# Altium schematic sheet POWER_SUPPLY.SchDoc
size D; SheetNumber: 6; SheetTotal: 7
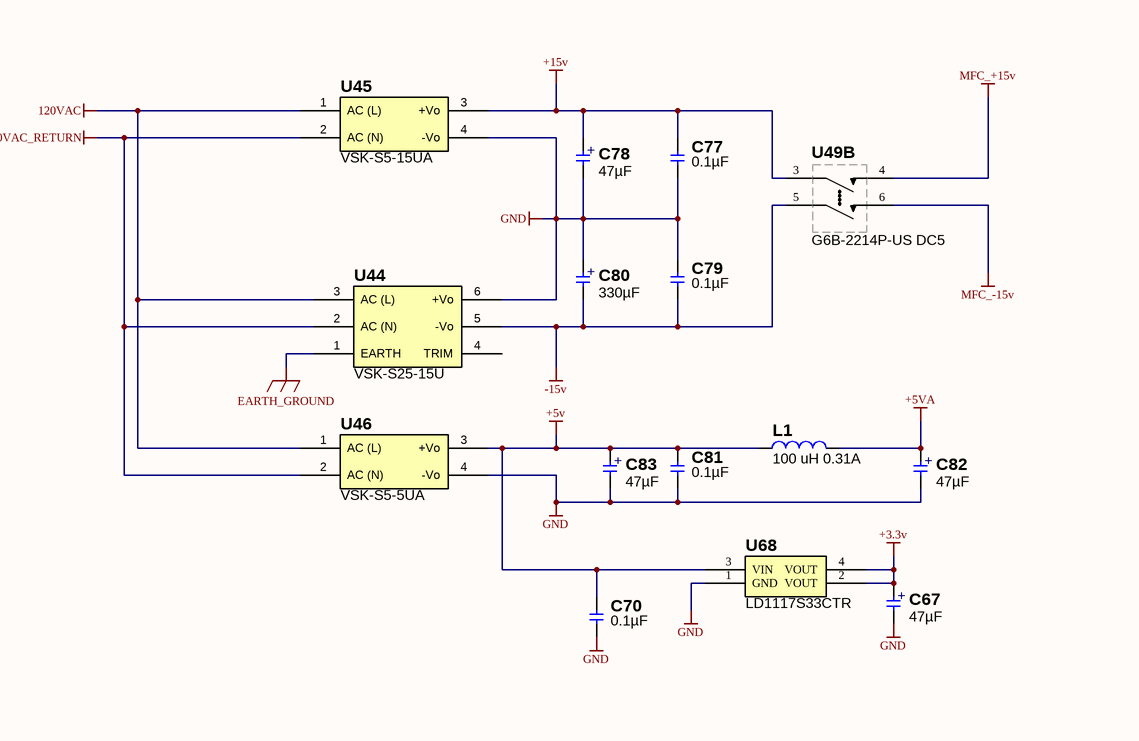
[diagram p0: POWER_SUPPLY.SchDoc, left]
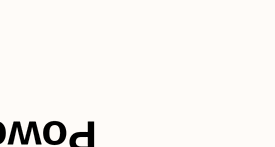
[diagram p1: POWER_SUPPLY.SchDoc, right]

## Parts
C67  47µF  [C_ALU_D]
C70  0.1µF  [C0805_LD]
C77  0.1µF  [C0805_LD]
C78  47µF  [C_ALU_D]
C79  0.1µF  [C0805_LD]
C80  330µF  [C_ALU_F]
C81  0.1µF  [C0805_LD]
C82  47µF  [C_ALU_D]
C83  47µF  [C_ALU_D]
L1  100 uH 0.31A  [L_DO1608C]
U44  VSK-S25-15U  [VSK-S25]
U45  VSK-S5-15UA  [VSK-S5]
U46  VSK-S5-5UA  [VSK-S5]
U49  G6B-2214P-US DC5  [G6B-2214P-US]  (part B of 2)
U68  LD1117S33CTR  [SOT223]

## Nets
120VAC: U44.3(AC_(L)) U45.1(AC_(L)) U46.1(AC_(L))
120VAC_RETURN: U44.2(AC_(N)) U45.2(AC_(N)) U46.2(AC_(N))
+3.3v: C67.1 U68.2(VOUT) U68.4(VOUT)
+5v: C70.2 C81.2 C83.1 L1.1 U46.3(+Vo) U68.3(VIN)
+5VA: C82.1 L1.2
+15v: C77.2 C78.1 U45.3(+Vo) U49.3
-15v: C79.1 C80.2 U44.5(-Vo) U49.5
EARTH_GROUND: U44.1(EARTH)
GND: C67.2 C70.1 C77.1 C78.2 C79.2 C80.1 C81.1 C82.2 C83.2 U44.6(+Vo) U45.4(-Vo) U46.4(-Vo) U68.1(GND)
MFC_+15v: U49.4
MFC_-15v: U49.6

Not connected (* = marked no-connect by the designer): U44 4(TRIM)

## Notes on the sheet
- Power Supply
- -1
- Wavenumber LLC
- 2pl
- Rev:
- Sheet
- of
- (in symbol EEE-FK1E331P) +
- (in symbol EEE-FK1E470P) +

## Library data of the parts
C67 C78 C82 C83 = EEE-FK1E470P: CAP ALUM 47UF 25V 20% SMD; Manufacturer: Panasonic Electronic Components; Lifetime @ Temp#: 2000 Hrs @ 105°C; Ripple Current: 240mA; Impedance: 360 mOhm; Surface Mount Land Size: 0.260" L x 0.260" W (6.60mm x 6.60mm); F40: 0P; Value: 47µF; Temperature Coefficient: Temperature Coefficient; Manufacturer Part Number: EEE-FK1E470P; ComponentLink1Description: Internal Datasheet; ComponentLink1URL: http://industrial.panasonic.com/www-cgi/jvcr13pz.cgi?E+PZ+3+ABA0120+EEEFK1E470P+7+WW; ComponentLink2Description: External Datasheet; ComponentLink2URL: http://industrial.panasonic.com/www-cgi/jvcr13pz.cgi?E+PZ+3+ABA0120+EEEFK1E470P+7+WW; Stocked: 0; Supplier 1: Digi-Key; Supplier Part Number 1: PCE3804CT-ND; Category: Capacitors; SortValue: 47000000; Sort Value Package: D_47000000; Pricing: 1 = 0.56  ;  50 = 0.3364  ;  100 = 0.2944  ;  250 = 0.23132  ;  500 = 0.2103 (USD); Sales Status: Active; Capacitance: 47µF; Voltage Rating: 25V; Tolerance: ±20%; Operating Temperature: -55°C ~ 105°C; Features: General Purpose; ESR (Equivalent Series Resistance): -; Mounting Type: Surface Mount; Package / Case: Radial- Can - SMD; Size / Dimension: 0.248" Dia (6.30mm); Height - Seated (Max): 0.228" (5.80mm); Lead Spacing: -; Packaging: Cut Tape (CT); Diameter: 6.30; Height: 5.80; Package: D
C70 C77 C79 C81 = GRM21BR71H104KA01L: CAP CER 0.1UF 50V 10% X7R 0805; Manufacturer: Murata Electronics North America; Value: 0.1µF; Temperature Coefficient: X7R; Manufacturer Part Number: GRM21BR71H104KA01L; ComponentLink1Description: \\altium.sil.arl.psu.edu\Libraries\datasheets\Murata Electronics North America\c02e.pdf; ComponentLink1URL: http://search.murata.co.jp/Ceramy/image/img/A01X/G101/ENG/GRM1555C1HR60WA01-01.pdf; ComponentLink2Description: External Datasheet; ComponentLink2URL: http://www.murata.com/products/catalog/pdf/c02e.pdf; Stocked: 0; Supplier 1: Digi-Key; Supplier Part Number 1: 490-1666-1-ND; Category: Capacitors; Sort Value: 100000; Sort Value Package: 0805_100000; Pricing: 1 = 0.1  ;  10 = 0.046  ;  50 = 0.0248  ;  100 = 0.0209  ;  250 = 0.01712  ;  500 = 0.01464  ;  1000 = 0.0114 (USD); Sales Status: Active; Capacitance: 0.1µF; Voltage - Rated: 50V; Tolerance: ±10%; Mounting Type: Surface Mount- MLCC; Operating Temperature: -55°C ~ 125°C; Applications: General Purpose; Ratings: -; Package / Case: 0805 (2012 Metric); Size / Dimension: 0.079" L x 0.049" W (2.00mm x 1.25mm); Height - Seated (Max): -; Thickness (Max): 0.053" (1.35mm); Lead Spacing: -; Features: -; Packaging: Cut Tape (CT); Lead Style: -; Package: 0805; Thickness: 135
C80 = EEE-FK1E331P: CAP ALUM 330UF 25V 20% SMD; Manufacturer: Panasonic Electronic Components; Lifetime @ Temp#: 2000 Hrs @ 105°C; Ripple Current: 600mA; Impedance: 160 mOhm; Surface Mount Land Size: 0.327" L x 0.327" W (8.30mm x 8.30mm); F40: 1P; Value: 330µF; Temperature Coefficient: Temperature Coefficient; Manufacturer Part Number: EEE-FK1E331P; ComponentLink1Description: Internal Datasheet; ComponentLink1URL: http://industrial.panasonic.com/www-cgi/jvcr13pz.cgi?E+PZ+3+ABA0120+EEEFK1E331P+7+WW; ComponentLink2Description: External Datasheet; ComponentLink2URL: http://industrial.panasonic.com/www-cgi/jvcr13pz.cgi?E+PZ+3+ABA0120+EEEFK1E331P+7+WW; Stocked: 0; Supplier 1: Digi-Key; Supplier Part Number 1: PCE3803CT-ND; Category: Capacitors; SortValue: 330000000; Sort Value Package: F_330000000; Pricing: 1 = 0.93  ;  50 = 0.5948  ;  100 = 0.5353  ;  250 = 0.46096 (USD); Sales Status: Active; Capacitance: 330µF; Voltage Rating: 25V; Tolerance: ±20%; Operating Temperature: -55°C ~ 105°C; Features: General Purpose; ESR (Equivalent Series Resistance): -; Mounting Type: Surface Mount; Package / Case: Radial- Can - SMD; Size / Dimension: 0.315" Dia (8.00mm); Height - Seated (Max): 0.402" (10.20mm); Lead Spacing: -; Packaging: Cut Tape (CT); Diameter: 8.00; Height: 10.20; Package: F
L1 = DO1608C-104_L: Manufacturer: Coilcraft; Part Number: DO1608C-104_L_; CategorySort: 300; Inductance (uH): 100; DCR Max (Ohms): 1.27; SRF typ (MHz): 9; Isat (A): 0.31; IRMS (A) 20 rise: 0.37; IRMS (A) 40 rise: 0.5; Shielding: Unshielded; Category: Inductors; Value: 100 uH 0.31A; Manufacturer Part Number: DO1608C-104_L; ComponentLink1Description: Internal Datasheet; ComponentLink1URL: http://www.coilcraft.com/pdf_viewer/showpdf.cfm?f=pdf_store:do1608c.pdf; ComponentLink2Description: External Datasheet; ComponentLink2URL: http://www.coilcraft.com/pdf_viewer/showpdf.cfm?f=pdf_store:do1608c.pdf; Stocked: 0; Sort Value: 100; Sort Value Package: DO1608C_100; Supplier 1: Coilcraft; Supplier Part Number 1: DO1608C-104_L; Supplier Unit Price 1: 0.88; Package: DO1608C; Height (mm): 2.92
U44 = VSK-S25-15U: CONV AC/DC 25W 15V 1.6A PCB; Manufacturer: CUI Inc; Number of Outputs: 1; Voltage - Input: 85 ~ 264 VAC; Power Supply Type: Switching (Closed Frame); Efficiency: 83%; Power (Watts) - Max: 24W; Line Regulation: ±0.5%; Load Regulation: ±1%; Approvals: CE, cULus, EN, IEC; Value: VSK-S25-15U; Supplier 1: Digi-Key; Supplier Part Number 1: 102-2413-ND; Manufacturer Part Number: VSK-S25-15U; RoHS: RoHS Compliant; Category: Power Supplies - Board Mount; Stock 1: 77; Pricing 1: 1=33.85, 5=32.852, 10=31.856, 50=29.865, 100=28.8695, 250=27.874, 500=27.37626 (USD); Voltage - Output 1: 15V; Voltage - Output 2: -; Voltage - Output 3: -; Voltage - Output 4: -; Current - Output (Max): 1.6A; Power (Watts): 25W; Applications: Commercial; Features: OCP, OTP, OVP, SCP; Operating Temperature: -25°C ~ 70°C; Mounting Type: Through Hole; Size / Dimension: 2.75" L x 1.89" W x 0.94" H (70.0mm x 48.0mm x 24.0mm); Weight: 0.265 lb (120.2g); ComponentLink1URL: http://www.cui.com/Product/Resource/DigiKeyPDF/VSK-S25.pdf; ComponentLink1Description: http://www.cui.com/Product/Resource/DigiKeyPDF/VSK-S25.pdf
U45 = VSK-S5-15UA: CONV AC/DC 5W 15V 0.33A PCB; Manufacturer: CUI Inc; Number of Outputs: 1; Voltage - Input: 85 ~ 264 VAC; Current - Output (Max): 330mA; Power Supply Type: Switching (Closed Frame); Efficiency: 76%; Line Regulation: ±0.5%; Load Regulation: ±1%; Approvals: CE, cULus, EN; Value: VSK-S5-15UA; Supplier 1: Digi-Key; Supplier Part Number 1: 102-2389-ND; Manufacturer Part Number: VSK-S5-15UA; RoHS: RoHS Compliant; Category: Power Supplies - Board Mount; Stock 1: 248; Pricing 1: 1=16.33, 5=16.094, 10=15.861, 50=14.4616, 100=13.995, 250=13.52852, 500=13.062 (USD); Voltage - Output 1: 15V; Voltage - Output 2: -; Voltage - Output 3: -; Voltage - Output 4: -; Power (Watts): 5W; Applications: Commercial; Features: OTP, OVP, SCP; Operating Temperature: -25°C ~ 70°C; Mounting Type: Through Hole; Size / Dimension: 2.00" L x 1.00" W x 0.62" H (50.8mm x 25.4mm x 15.7mm); Power (Watts) - Max: 5W; Weight: 0.077 lb (34.93g); ComponentLink1URL: http://www.cui.com/Product/Resource/DigiKeyPDF/VSK-S5_Series.pdf; ComponentLink1Description: http://www.cui.com/Product/Resource/DigiKeyPDF/VSK-S5_Series.pdf
U46 = VSK-S5-5UA: CONV AC/DC 5W 5V 1A PCB; Manufacturer: CUI Inc; Number of Outputs: 1; Voltage - Input: 85 ~ 264 VAC; Power Supply Type: Switching (Closed Frame); Efficiency: 72%; Line Regulation: ±0.5%; Load Regulation: ±1%; Approvals: CE, cULus, EN; Value: VSK-S5-5UA; Supplier 1: Digi-Key; Supplier Part Number 1: 102-2386-ND; Manufacturer Part Number: VSK-S5-5UA; RoHS: RoHS Compliant; Category: Power Supplies - Board Mount; Stock 1: 1594; Pricing 1: 1=16.33, 5=16.094, 10=15.861, 50=14.4616, 100=13.995, 250=13.52852, 500=13.062 (USD); Voltage - Output 1: 5V; Voltage - Output 2: -; Voltage - Output 3: -; Voltage - Output 4: -; Current - Output (Max): 1A; Power (Watts): 5W; Applications: Commercial; Features: OTP, OVP, SCP; Operating Temperature: -25°C ~ 70°C; Mounting Type: Through Hole; Size / Dimension: 2.00" L x 1.00" W x 0.62" H (50.8mm x 25.4mm x 15.7mm); Power (Watts) - Max: 5W; Weight: 0.077 lb (34.93g); ComponentLink1URL: http://www.cui.com/Product/Resource/DigiKeyPDF/VSK-S5_Series.pdf; ComponentLink1Description: http://www.cui.com/Product/Resource/DigiKeyPDF/VSK-S5_Series.pdf
U49 = G6B-2214P-US DC5: RELAY GENERAL PURPOSE DPST 5A 5V; Manufacturer: Omron Electronics Inc-EMC Div; Coil Type: Non Latching; Coil Current: 60mA; Coil Voltage: 5VDC; Contact Form: DPST (2 Form A); Switching Voltage: 380VAC, 125VDC - Max; Turn On Voltage (Max): 4 VDC; Turn Off Voltage (Min): 0.5 VDC; Operate Time: 10ms; Coil Power: 300 mW; Coil Resistance: 83.3 Ohms; Value: G6B-2214P-US DC5; Supplier 1: Digi-Key; Supplier Part Number 1: Z947-ND; Manufacturer Part Number: G6B-2214P-US DC5; RoHS: RoHS Compliant; Category: Relays; Stock 1: 2840; Pricing 1: 1=7.27, 10=6.816, 25=6.0584, 50=5.7556, 100=5.4526, 250=4.84676, 500=4.54384, 1000=4.24092, 2500=4.16519 (USD); Packaging: Bulk; Relay Type: General Purpose; Contact Rating (Current): 5A; Release Time: 10ms; Features: Sealed - Fully; Mounting Type: Through Hole; Termination Style: PC Pin; Contact Material: Silver Alloy, Cadmium Free; Operating Temperature: -25°C ~ 70°C; ComponentLink1URL: http://www.components.omron.com/components/web/PDFLIB.nsf/0/4287C4A29AD8E88785257201007DD690/$file/G6B_0911.pdf; ComponentLink1Description: http://www.components.omron.com/components/web/PDFLIB.nsf/0/4287C4A29AD8E88785257201007DD690/$file/G6B_0911.pdf
U68 = LD1117S33CTR: IC REG LDO 3.3V 950MA SOT-223; Manufacturer: STMicroelectronics; Regulator Topology: Positive Fixed; Voltage - Input: Up to 15V; Voltage - Dropout (Typical): 1.1V @ 800mA; Number of Regulators: 1; Supplier 1: Digi-Key; Supplier Part Number 1: 497-1241-1-ND; Manufacturer Part Number: LD1117S33CTR; RoHS: RoHS Compliant; Category: Integrated Circuits (ICs); Stock 1: 20460; Pricing 1: 1=0.54, 10=0.436, 100=0.3267, 250=0.28216, 500=0.24256, 1000=0.1881 (USD); Voltage - Output: 3.3V; Current - Output: 950mA; Current - Limit (Min): -; Operating Temperature: -40°C ~ 125°C; Mounting Type: Surface Mount; Package / Case: TO-261-4, TO-261AA; Supplier Device Package: SOT-223; Packaging: Cut Tape (CT); ComponentLink1URL: http://www.st.com/internet/com/TECHNICAL_RESOURCES/TECHNICAL_LITERATURE/DATASHEET/CD00000544.pdf; ComponentLink1Description: http://www.st.com/internet/com/TECHNICAL_RESOURCES/TECHNICAL_LITERATURE/DATASHEET/CD00000544.pdf; value: LD1117S33CTR